# EAGLE schematic OSSC_HDMI_Audio_v1.5_A3 (EAGLE 7.6.0)
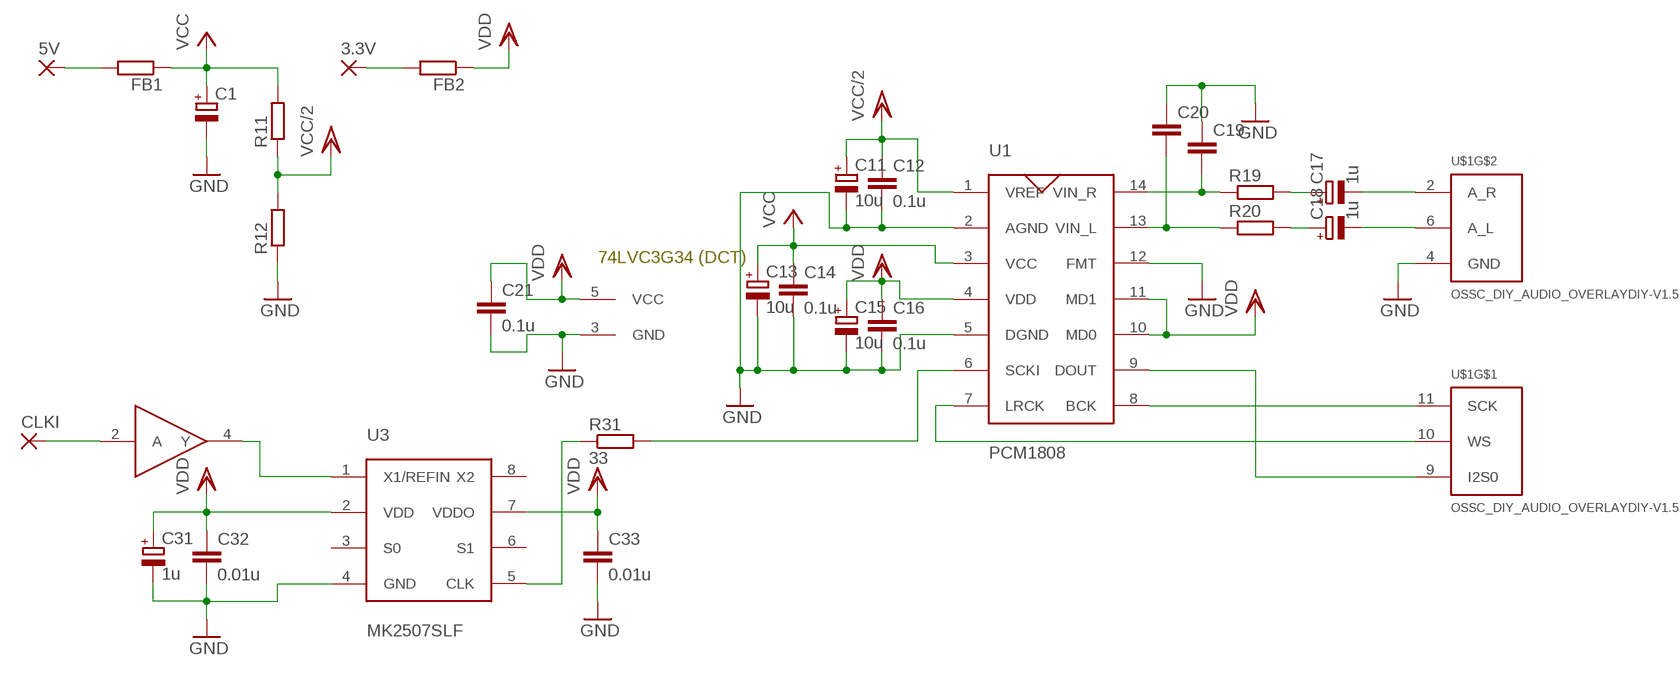
[diagram p0: schematic, sheet 1]

## Parts
3.3V  SMD2  [SMD1,27-2,54]
5V  SMD2  [SMD1,27-2,54]
C1  CPOL-EUSMCC  [SMC_C]
C11  10u  CPOL-EUSMCA  [SMC_A]
C12  0.1u  C-EUC0603  [C0603]
C13  10u  CPOL-EUSMCA  [SMC_A]
C14  0.1u  C-EUC0603  [C0603]
C15  10u  CPOL-EUSMCA  [SMC_A]
C16  0.1u  C-EUC0603  [C0603]
C17  1u  CPOL-EUSMCA  [SMC_A]
C18  1u  CPOL-EUSMCA  [SMC_A]
C19  C-EUC0603  [C0603]
C20  C-EUC0603  [C0603]
C21  0.1u  C-EUC0603  [C0603]
C31  1u  CPOL-EUSMCA  [SMC_A]
C32  0.01u  C-EUC0603  [C0603]
C33  0.01u  C-EUC0603  [C0603]
CLKI  SMD2  [SMD1,27-2,54]
FB1  R-EU_R0603  [R0603]
FB2  R-EU_R0603  [R0603]
R11  R-EU_R0603  [R0603]
R12  R-EU_R0603  [R0603]
R19  R-EU_R0603  [R0603]
R20  R-EU_R0603  [R0603]
R31  33  R-EU_R0603  [R0603]
U1  PCM1808  [PCM1808]
U2  74LVC1G34  [74LVC1G34DCK]
U3  MK2507SLF  [SOIC8]
U$1  OSSC_DIY_AUDIO_OVERLAYDIY-V1.5  [OSSC_OVERLAY_V1.5]

## Nets
GND: C1.- C11.- C12.2 C13.- C14.2 C15.- C16.2 C19.1 C20.1 C21.2 C31.- C32.2 C33.2 R12.1 U1.2(AGND) U1.5(DGND) U1.12(FMT) U2.3(GND) U3.4(GND) U$1.4(GND)
N$1: C18.- U$1.6(A_L)
N$2: C17.- U$1.2(A_R)
N$3: C17.+ R19.2
N$4: C19.2 R19.1 U1.14(VIN_R)
N$5: C20.2 R20.1 U1.13(VIN_L)
N$6: C18.+ R20.2
N$7: R31.1 U3.5(CLK)
N$8: U2.4(Y) U3.1(X1/REFIN)
N$9: CLKI.1(P) U2.2(A)
N$10: 5V.1(P) FB1.2
N$11: 3.3V.1(P) FB2.2
N$13: U1.7(LRCK) U$1.10(WS)
N$14: U1.8(BCK) U$1.11(SCK)
N$15: U1.9(DOUT) U$1.9(I2S0)
N$17: R31.2 U1.6(SCKI)
VCC: C1.+ C13.+ C14.1 FB1.1 R11.2 U1.3(VCC)
VCC/2: C11.+ C12.1 R11.1 R12.2 U1.1(VREF)
VDD: C15.+ C16.1 C21.1 C31.+ C32.1 C33.1 FB2.1 U1.4(VDD) U1.10(MD0) U1.11(MD1) U2.5(VCC) U3.2(VDD) U3.7(VDDO)
Unconnected: U3.3(S0) U3.6(S1) U3.8(X2)

## Notes on the sheet
- 74LVC3G34 (DCT)

## Library data of the parts
3.3V 5V CLKI = wirepad:SMD2: SMD PAD
C1 C11 C13 C15 C17 C18 C31 = rcl:CPOL-EU: POLARIZED CAPACITOR, European symbol
C12 C14 C16 C19-C21 C32 C33 = rcl:C-EU: CAPACITOR, European symbol
FB1 FB2 R11 R12 R19 R20 R31 = rcl:R-EU_: RESISTOR, European symbol
U1 = OSSC_HDMI_Audio:PCM1808
U2 = OSSC_HDMI_Audio:74LVC1G34
U3 = OSSC_HDMI_Audio:MK2507SLF
U$1 = OSSC_HDMI_Audio:OSSC_DIY_AUDIO_OVERLAY